# EAGLE design Stimulation_Testbed_Expansion_V2 (EAGLE 7.5.0)
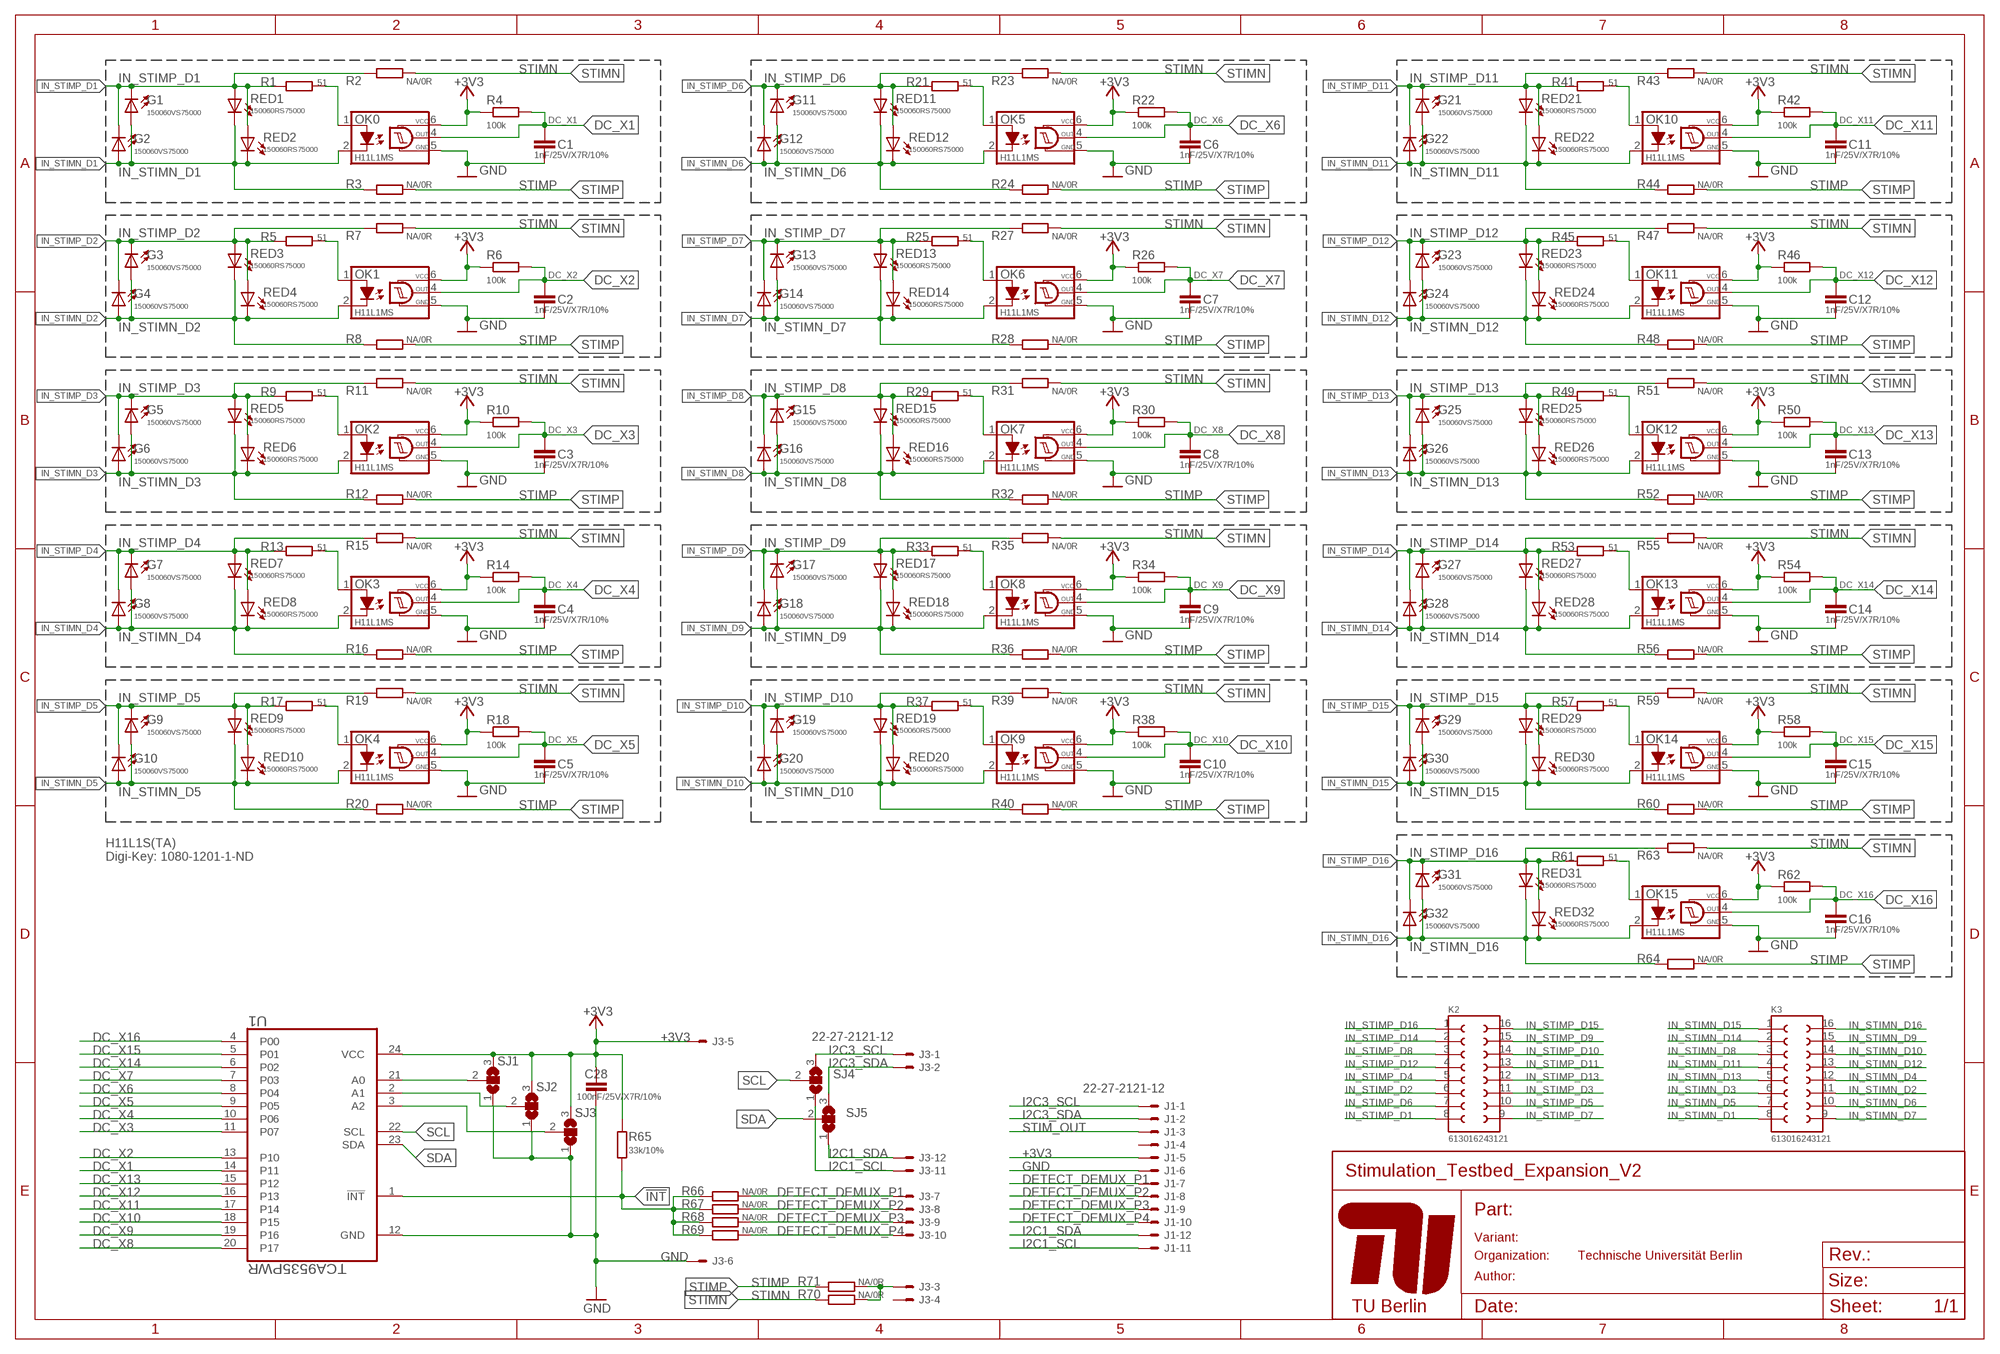
[diagram p0: schematic, sheet 1]

## Parts
C1  1nF/25V/X7R/10%  C-EUC0603  [C0603]
C2  1nF/25V/X7R/10%  C-EUC0603  [C0603]
C3  1nF/25V/X7R/10%  C-EUC0603  [C0603]
C4  1nF/25V/X7R/10%  C-EUC0603  [C0603]
C5  1nF/25V/X7R/10%  C-EUC0603  [C0603]
C6  1nF/25V/X7R/10%  C-EUC0603  [C0603]
C7  1nF/25V/X7R/10%  C-EUC0603  [C0603]
C8  1nF/25V/X7R/10%  C-EUC0603  [C0603]
C9  1nF/25V/X7R/10%  C-EUC0603  [C0603]
C10  1nF/25V/X7R/10%  C-EUC0603  [C0603]
C11  1nF/25V/X7R/10%  C-EUC0603  [C0603]
C12  1nF/25V/X7R/10%  C-EUC0603  [C0603]
C13  1nF/25V/X7R/10%  C-EUC0603  [C0603]
C14  1nF/25V/X7R/10%  C-EUC0603  [C0603]
C15  1nF/25V/X7R/10%  C-EUC0603  [C0603]
C16  1nF/25V/X7R/10%  C-EUC0603  [C0603]
C28  100nF/25V/X7R/10%  C-EUC0603K  [C0603K]
G1  150060VS75000  LEDCHIPLED_0603  [CHIPLED_0603]
G2  150060VS75000  LEDCHIPLED_0603  [CHIPLED_0603]
G3  150060VS75000  LEDCHIPLED_0603  [CHIPLED_0603]
G4  150060VS75000  LEDCHIPLED_0603  [CHIPLED_0603]
G5  150060VS75000  LEDCHIPLED_0603  [CHIPLED_0603]
G6  150060VS75000  LEDCHIPLED_0603  [CHIPLED_0603]
G7  150060VS75000  LEDCHIPLED_0603  [CHIPLED_0603]
G8  150060VS75000  LEDCHIPLED_0603  [CHIPLED_0603]
G9  150060VS75000  LEDCHIPLED_0603  [CHIPLED_0603]
G10  150060VS75000  LEDCHIPLED_0603  [CHIPLED_0603]
G11  150060VS75000  LEDCHIPLED_0603  [CHIPLED_0603]
G12  150060VS75000  LEDCHIPLED_0603  [CHIPLED_0603]
G13  150060VS75000  LEDCHIPLED_0603  [CHIPLED_0603]
G14  150060VS75000  LEDCHIPLED_0603  [CHIPLED_0603]
G15  150060VS75000  LEDCHIPLED_0603  [CHIPLED_0603]
G16  150060VS75000  LEDCHIPLED_0603  [CHIPLED_0603]
G17  150060VS75000  LEDCHIPLED_0603  [CHIPLED_0603]
G18  150060VS75000  LEDCHIPLED_0603  [CHIPLED_0603]
G19  150060VS75000  LEDCHIPLED_0603  [CHIPLED_0603]
G20  150060VS75000  LEDCHIPLED_0603  [CHIPLED_0603]
G21  150060VS75000  LEDCHIPLED_0603  [CHIPLED_0603]
G22  150060VS75000  LEDCHIPLED_0603  [CHIPLED_0603]
G23  150060VS75000  LEDCHIPLED_0603  [CHIPLED_0603]
G24  150060VS75000  LEDCHIPLED_0603  [CHIPLED_0603]
G25  150060VS75000  LEDCHIPLED_0603  [CHIPLED_0603]
G26  150060VS75000  LEDCHIPLED_0603  [CHIPLED_0603]
G27  150060VS75000  LEDCHIPLED_0603  [CHIPLED_0603]
G28  150060VS75000  LEDCHIPLED_0603  [CHIPLED_0603]
G29  150060VS75000  LEDCHIPLED_0603  [CHIPLED_0603]
G30  150060VS75000  LEDCHIPLED_0603  [CHIPLED_0603]
G31  150060VS75000  LEDCHIPLED_0603  [CHIPLED_0603]
G32  150060VS75000  LEDCHIPLED_0603  [CHIPLED_0603]
J1  22-27-2121-12  [6410-12]
J3  22-27-2121-12  [6410-12]
K2  613016243121  [613016243121]
K3  613016243121  [613016243121]
OK0  H11L1MS  [DIL6-SMD]
OK1  H11L1MS  [DIL6-SMD]
OK2  H11L1MS  [DIL6-SMD]
OK3  H11L1MS  [DIL6-SMD]
OK4  H11L1MS  [DIL6-SMD]
OK5  H11L1MS  [DIL6-SMD]
OK6  H11L1MS  [DIL6-SMD]
OK7  H11L1MS  [DIL6-SMD]
OK8  H11L1MS  [DIL6-SMD]
OK9  H11L1MS  [DIL6-SMD]
OK10  H11L1MS  [DIL6-SMD]
OK11  H11L1MS  [DIL6-SMD]
OK12  H11L1MS  [DIL6-SMD]
OK13  H11L1MS  [DIL6-SMD]
OK14  H11L1MS  [DIL6-SMD]
OK15  H11L1MS  [DIL6-SMD]
R1  51  R-EU_R0603  [R0603]
R2  NA/0R  R-EU_R0603  [R0603]
R3  NA/0R  R-EU_R0603  [R0603]
R4  100k  R-EU_R0603  [R0603]
R5  51  R-EU_R0603  [R0603]
R6  100k  R-EU_R0603  [R0603]
R7  NA/0R  R-EU_R0603  [R0603]
R8  NA/0R  R-EU_R0603  [R0603]
R9  51  R-EU_R0603  [R0603]
R10  100k  R-EU_R0603  [R0603]
R11  NA/0R  R-EU_R0603  [R0603]
R12  NA/0R  R-EU_R0603  [R0603]
R13  51  R-EU_R0603  [R0603]
R14  100k  R-EU_R0603  [R0603]
R15  NA/0R  R-EU_R0603  [R0603]
R16  NA/0R  R-EU_R0603  [R0603]
R17  51  R-EU_R0603  [R0603]
R18  100k  R-EU_R0603  [R0603]
R19  NA/0R  R-EU_R0603  [R0603]
R20  NA/0R  R-EU_R0603  [R0603]
R21  51  R-EU_R0603  [R0603]
R22  100k  R-EU_R0603  [R0603]
R23  NA/0R  R-EU_R0603  [R0603]
R24  NA/0R  R-EU_R0603  [R0603]
R25  51  R-EU_R0603  [R0603]
R26  100k  R-EU_R0603  [R0603]
R27  NA/0R  R-EU_R0603  [R0603]
R28  NA/0R  R-EU_R0603  [R0603]
R29  51  R-EU_R0603  [R0603]
R30  100k  R-EU_R0603  [R0603]
R31  NA/0R  R-EU_R0603  [R0603]
R32  NA/0R  R-EU_R0603  [R0603]
R33  51  R-EU_R0603  [R0603]
R34  100k  R-EU_R0603  [R0603]
R35  NA/0R  R-EU_R0603  [R0603]
R36  NA/0R  R-EU_R0603  [R0603]
R37  51  R-EU_R0603  [R0603]
R38  100k  R-EU_R0603  [R0603]
R39  NA/0R  R-EU_R0603  [R0603]
R40  NA/0R  R-EU_R0603  [R0603]
R41  51  R-EU_R0603  [R0603]
R42  100k  R-EU_R0603  [R0603]
R43  NA/0R  R-EU_R0603  [R0603]
R44  NA/0R  R-EU_R0603  [R0603]
R45  51  R-EU_R0603  [R0603]
R46  100k  R-EU_R0603  [R0603]
R47  NA/0R  R-EU_R0603  [R0603]
R48  NA/0R  R-EU_R0603  [R0603]
R49  51  R-EU_R0603  [R0603]
R50  100k  R-EU_R0603  [R0603]
R51  NA/0R  R-EU_R0603  [R0603]
R52  NA/0R  R-EU_R0603  [R0603]
R53  51  R-EU_R0603  [R0603]
R54  100k  R-EU_R0603  [R0603]
R55  NA/0R  R-EU_R0603  [R0603]
R56  NA/0R  R-EU_R0603  [R0603]
R57  51  R-EU_R0603  [R0603]
R58  100k  R-EU_R0603  [R0603]
R59  NA/0R  R-EU_R0603  [R0603]
R60  NA/0R  R-EU_R0603  [R0603]
R61  51  R-EU_R0603  [R0603]
R62  100k  R-EU_R0603  [R0603]
R63  NA/0R  R-EU_R0603  [R0603]
R64  NA/0R  R-EU_R0603  [R0603]
R65  33k/10%  R-EU_R0603  [R0603]
R66  NA/0R  R-EU_R0603  [R0603]
R67  NA/0R  R-EU_R0603  [R0603]
R68  NA/0R  R-EU_R0603  [R0603]
R69  NA/0R  R-EU_R0603  [R0603]
R70  NA/0R  R-EU_R0603  [R0603]
R71  NA/0R  R-EU_R0603  [R0603]
RED1  150060RS75000  LEDCHIP-LED0603  [CHIP-LED0603]
RED2  150060RS75000  LEDCHIP-LED0603  [CHIP-LED0603]
RED3  150060RS75000  LEDCHIP-LED0603  [CHIP-LED0603]
RED4  150060RS75000  LEDCHIP-LED0603  [CHIP-LED0603]
RED5  150060RS75000  LEDCHIP-LED0603  [CHIP-LED0603]
RED6  150060RS75000  LEDCHIP-LED0603  [CHIP-LED0603]
RED7  150060RS75000  LEDCHIP-LED0603  [CHIP-LED0603]
RED8  150060RS75000  LEDCHIP-LED0603  [CHIP-LED0603]
RED9  150060RS75000  LEDCHIP-LED0603  [CHIP-LED0603]
RED10  150060RS75000  LEDCHIP-LED0603  [CHIP-LED0603]
RED11  150060RS75000  LEDCHIP-LED0603  [CHIP-LED0603]
RED12  150060RS75000  LEDCHIP-LED0603  [CHIP-LED0603]
RED13  150060RS75000  LEDCHIP-LED0603  [CHIP-LED0603]
RED14  150060RS75000  LEDCHIP-LED0603  [CHIP-LED0603]
RED15  150060RS75000  LEDCHIP-LED0603  [CHIP-LED0603]
RED16  150060RS75000  LEDCHIP-LED0603  [CHIP-LED0603]
RED17  150060RS75000  LEDCHIP-LED0603  [CHIP-LED0603]
RED18  150060RS75000  LEDCHIP-LED0603  [CHIP-LED0603]
RED19  150060RS75000  LEDCHIP-LED0603  [CHIP-LED0603]
RED20  150060RS75000  LEDCHIP-LED0603  [CHIP-LED0603]
RED21  150060RS75000  LEDCHIP-LED0603  [CHIP-LED0603]
RED22  150060RS75000  LEDCHIP-LED0603  [CHIP-LED0603]
RED23  150060RS75000  LEDCHIP-LED0603  [CHIP-LED0603]
RED24  150060RS75000  LEDCHIP-LED0603  [CHIP-LED0603]
RED25  150060RS75000  LEDCHIP-LED0603  [CHIP-LED0603]
RED26  150060RS75000  LEDCHIP-LED0603  [CHIP-LED0603]
RED27  150060RS75000  LEDCHIP-LED0603  [CHIP-LED0603]
RED28  150060RS75000  LEDCHIP-LED0603  [CHIP-LED0603]
RED29  150060RS75000  LEDCHIP-LED0603  [CHIP-LED0603]
RED30  150060RS75000  LEDCHIP-LED0603  [CHIP-LED0603]
RED31  150060RS75000  LEDCHIP-LED0603  [CHIP-LED0603]
RED32  150060RS75000  LEDCHIP-LED0603  [CHIP-LED0603]
SJ1  SJ2W  [SJ_2]
SJ2  SJ2W  [SJ_2]
SJ3  SJ2W  [SJ_2]
SJ4  SJ2W  [SJ_2]
SJ5  SJ2W  [SJ_2]
U1  TCA9535PWR  [SOP65P640X120-24N]

## Nets
!INT: R65.1 R66.2 R67.2 R68.2 R69.2 U1.1(!INT)
+3V3: C28.1 J1.5 J3.5 OK0.6(VCC) OK1.6(VCC) OK2.6(VCC) OK3.6(VCC) OK4.6(VCC) OK5.6(VCC) OK6.6(VCC) OK7.6(VCC) OK8.6(VCC) OK9.6(VCC) OK10.6(VCC) OK11.6(VCC) OK12.6(VCC) OK13.6(VCC) OK14.6(VCC) OK15.6(VCC) R4.1 R6.1 R10.1 R14.1 R18.1 R22.1 R26.1 R30.1 R34.1 R38.1 R42.1 R46.1 R50.1 R54.1 R58.1 R62.1 R65.2 SJ1.3 SJ2.3 SJ3.3 U1.24(VCC)
DC_X1: C1.1 OK0.4(OUT) R4.2 U1.14(P11)
DC_X2: C2.1 OK1.4(OUT) R6.2 U1.13(P10)
DC_X3: C3.1 OK2.4(OUT) R10.2 U1.11(P07)
DC_X4: C4.1 OK3.4(OUT) R14.2 U1.10(P06)
DC_X5: C5.1 OK4.4(OUT) R18.2 U1.9(P05)
DC_X6: C6.1 OK5.4(OUT) R22.2 U1.8(P04)
DC_X7: C7.1 OK6.4(OUT) R26.2 U1.7(P03)
DC_X8: C8.1 OK7.4(OUT) R30.2 U1.20(P17)
DC_X9: C9.1 OK8.4(OUT) R34.2 U1.19(P16)
DC_X10: C10.1 OK9.4(OUT) R38.2 U1.18(P15)
DC_X11: C11.1 OK10.4(OUT) R42.2 U1.17(P14)
DC_X12: C12.1 OK11.4(OUT) R46.2 U1.16(P13)
DC_X13: C13.1 OK12.4(OUT) R50.2 U1.15(P12)
DC_X14: C14.1 OK13.4(OUT) R54.2 U1.6(P02)
DC_X15: C15.1 OK14.4(OUT) R58.2 U1.5(P01)
DC_X16: C16.1 OK15.4(OUT) R62.2 U1.4(P00)
DETECT_DEMUX_P1: J1.7 J3.7 R66.1
DETECT_DEMUX_P2: J1.8 J3.8 R67.1
DETECT_DEMUX_P3: J1.9 J3.9 R68.1
DETECT_DEMUX_P4: J1.10 J3.10 R69.1
GND: C1.2 C2.2 C3.2 C4.2 C5.2 C6.2 C7.2 C8.2 C9.2 C10.2 C11.2 C12.2 C13.2 C14.2 C15.2 C16.2 C28.2 J1.6 J3.6 OK0.5(GND) OK1.5(GND) OK2.5(GND) OK3.5(GND) OK4.5(GND) OK5.5(GND) OK6.5(GND) OK7.5(GND) OK8.5(GND) OK9.5(GND) OK10.5(GND) OK11.5(GND) OK12.5(GND) OK13.5(GND) OK14.5(GND) OK15.5(GND) SJ1.1 SJ2.1 SJ3.1 U1.12(GND)
I2C1_SCL: J1.11 J3.11 SJ4.1
I2C1_SDA: J1.12 J3.12 SJ5.1
I2C3_SCL: J1.1 J3.1 SJ4.3
I2C3_SDA: J1.2 J3.2 SJ5.3
IN_STIMN_D1: G1.A G2.A K3.8 OK0.2(C) R3.2 RED1.C RED2.C
IN_STIMN_D2: G3.A G4.A K3.11 OK1.2(C) R8.2 RED3.C RED4.C
IN_STIMN_D3: G5.A G6.A K3.6 OK2.2(C) R12.2 RED5.C RED6.C
IN_STIMN_D4: G7.A G8.A K3.12 OK3.2(C) R16.2 RED7.C RED8.C
IN_STIMN_D5: G9.A G10.A K3.7 OK4.2(C) R20.2 RED9.C RED10.C
IN_STIMN_D6: G11.A G12.A K3.10 OK5.2(C) R24.2 RED11.C RED12.C
IN_STIMN_D7: G13.A G14.A K3.9 OK6.2(C) R28.2 RED13.C RED14.C
IN_STIMN_D8: G15.A G16.A K3.3 OK7.2(C) R32.2 RED15.C RED16.C
IN_STIMN_D9: G17.A G18.A K3.15 OK8.2(C) R36.2 RED17.C RED18.C
IN_STIMN_D10: G19.A G20.A K3.14 OK9.2(C) R40.2 RED19.C RED20.C
IN_STIMN_D11: G21.A G22.A K3.4 OK10.2(C) R44.2 RED21.C RED22.C
IN_STIMN_D12: G23.A G24.A K3.13 OK11.2(C) R48.2 RED23.C RED24.C
IN_STIMN_D13: G25.A G26.A K3.5 OK12.2(C) R52.2 RED25.C RED26.C
IN_STIMN_D14: G27.A G28.A K3.2 OK13.2(C) R56.2 RED27.C RED28.C
IN_STIMN_D15: G29.A G30.A K3.1 OK14.2(C) R60.2 RED29.C RED30.C
IN_STIMN_D16: G31.A G32.A K3.16 OK15.2(C) R64.2 RED31.C RED32.C
IN_STIMP_D1: G1.C G2.C K2.8 R1.2 R2.2 RED1.A RED2.A
IN_STIMP_D2: G3.C G4.C K2.6 R5.2 R7.2 RED3.A RED4.A
IN_STIMP_D3: G5.C G6.C K2.11 R9.2 R11.2 RED5.A RED6.A
IN_STIMP_D4: G7.C G8.C K2.5 R13.2 R15.2 RED7.A RED8.A
IN_STIMP_D5: G9.C G10.C K2.10 R17.2 R19.2 RED9.A RED10.A
IN_STIMP_D6: G11.C G12.C K2.7 R21.2 R23.2 RED11.A RED12.A
IN_STIMP_D7: G13.C G14.C K2.9 R25.2 R27.2 RED13.A RED14.A
IN_STIMP_D8: G15.C G16.C K2.3 R29.2 R31.2 RED15.A RED16.A
IN_STIMP_D9: G17.C G18.C K2.15 R33.2 R35.2 RED17.A RED18.A
IN_STIMP_D10: G19.C G20.C K2.14 R37.2 R39.2 RED19.A RED20.A
IN_STIMP_D11: G21.C G22.C K2.13 R41.2 R43.2 RED21.A RED22.A
IN_STIMP_D12: G23.C G24.C K2.4 R45.2 R47.2 RED23.A RED24.A
IN_STIMP_D13: G25.C G26.C K2.12 R49.2 R51.2 RED25.A RED26.A
IN_STIMP_D14: G27.C G28.C K2.2 R53.2 R55.2 RED27.A RED28.A
IN_STIMP_D15: G29.C G30.C K2.16 R57.2 R59.2 RED29.A RED30.A
IN_STIMP_D16: G31.C G32.C K2.1 R61.2 R63.2 RED31.A RED32.A
N$1: OK1.1(A) R5.1
N$2: OK2.1(A) R9.1
N$3: OK3.1(A) R13.1
N$4: OK4.1(A) R17.1
N$5: OK5.1(A) R21.1
N$6: OK6.1(A) R25.1
N$7: OK7.1(A) R29.1
N$8: OK9.1(A) R37.1
N$9: OK8.1(A) R33.1
N$10: OK10.1(A) R41.1
N$11: OK11.1(A) R45.1
N$12: OK12.1(A) R49.1
N$13: OK13.1(A) R53.1
N$14: OK14.1(A) R57.1
N$15: OK15.1(A) R61.1
N$16: SJ1.2 U1.21(A0)
N$17: SJ2.2 U1.2(A1)
N$18: SJ3.2 U1.3(A2)
N$30: OK0.1(A) R1.1
SCL: SJ4.2 U1.22(SCL)
SDA: SJ5.2 U1.23(SDA)
STIM_OUT: J1.3 J3.3 R70.1 R71.1
STIMN: R2.1 R7.1 R11.1 R15.1 R19.1 R23.1 R27.1 R31.1 R35.1 R39.1 R43.1 R47.1 R51.1 R55.1 R59.1 R63.1 R70.2
STIMP: R3.1 R8.1 R12.1 R16.1 R20.1 R24.1 R28.1 R32.1 R36.1 R40.1 R44.1 R48.1 R52.1 R56.1 R60.1 R64.1 R71.2
Unconnected: J1.4 J3.4

## Notes on the sheet
- H11L1S(TA)
  Digi-Key: 1080-1201-1-ND

## Library data of the parts
C1-C16 C28 = rcl:C-EU: CAPACITOR, European symbol
G1-G32 RED1-RED32 = led:LED: LED OSRAM: - CHIPLED LG R971, LG N971, LY N971, LG Q971, LY Q971, LO R971, LY R971 LH N974, LH R974 LS Q976, LO Q976, LY Q976 LO Q996 - Hyper CHIPLED LW Q18S LB Q993, LB Q99A, LB R99A - SideLED LS A670, LO A670, LY A670, LG A670, LP A670 LB A673, LV A673, LT A673, LW A673 LH A674 LY A675 LS A676, LA A676, LO A676, LY A676, LW A676 LS A679, LY A679, LG A679 - Hyper Micro SIDELED® LS Y876, LA Y876, LO Y876, LY Y876 LT Y87S - SmartLED LW L88C, LW L88S LB L89C, LB L89S, LG L890 LS L89K, LO L89K, LY L89K LS L896, LA L896, LO L896, LY L896 - TOPLED LS T670, LO T670, LY T670, LG T670, LP T670 LSG T670, LSP T670, LSY T670, LOP T670, LYG T670 LG T671, LOG T671, LSG T671 LB T673, LV T673, LT T673, LW T673 LH T674 LS T676, LA T676, LO T676, LY T676, LB T676, LH T676, LSB T676, LW T676 LB T67C, LV T67C, LT T67C, LS T67K, LO T67K, LY T67K, LW E67C LS E67B, LA E67B, LO E67B, LY E67B, LB E67C, LV E67C, LT E67C LW T67C LS T679, LY T679, LG T679 LS T770, LO T770, LY T770, LG T770, LP T770 LB T773, LV T773, LT T773, LW T773 LH T774 LS E675, LA E675, LY E675, LS T675 LS T776, LA T776, LO T776, LY T776, LB T776 LHGB T686 LT T68C, LB T68C - Hyper Mini TOPLED® LB M676 - Mini TOPLED Santana® LG M470 LS M47K, LO M47K, LY M47K Source: http://www.osram.convergy.de LUXEON: - LUMILED® LXK2-PW12-R00, LXK2-PW12-S00, LXK2-PW14-U00, LXK2-PW14-V00 LXK2-PM12-R00, LXK2-PM12-S00, LXK2-PM14-U00 LXK2-PE12-Q00, LXK2-PE12-R00, LXK2-PE12-S00, LXK2-PE14-T00, LXK2-PE14-U00 LXK2-PB12-K00, LXK2-PB12-L00, LXK2-PB12-M00, LXK2-PB14-N00, LXK2-PB14-P00, LXK2-PB14-Q00 LXK2-PR12-L00, LXK2-PR12-M00, LXK2-PR14-Q00, LXK2-PR14-R00 LXK2-PD12-Q00, LXK2-PD12-R00, LXK2-PD12-S00 LXK2-PH12-R00, LXK2-PH12-S00 LXK2-PL12-P00, LXK2-PL12-Q00, LXK2-PL12-R00 Source: www.luxeon.com KINGBRIGHT: KA-3528ASYC Source: www.kingbright.com
J1 J3 = con-molex:22-?-12: CONNECTOR wire to board 2.54 mm (.1 inch) pitch header; OC_FARNELL: unknown; OC_NEWARK: unknown
K2 K3 = Board-to-Board:613016243121: WR-PHD Angled Dual Socket Header, 16 Pins =>Code : Con_BTB_SHD_2.54_2_613016243121 <http://katalog.we-online.de/media/images/eican/Con_BTB_SHD_2.54_2_6130xx243121_pf2.jpg> Details see: http://katalog.we-online.de/en/em/613_0xx_243_121 Created 2014-05-30, Karrer Zheng 2014 (C) Würth Elektronik
OK0 OK1-OK15 = optocoupler:H11L*M: 6-Pin DIP Optocoupler Source: http://www.fairchildsemi.com/ds/H1/H11L2-M.pdf; OC_FARNELL: unknown; OC_NEWARK: unknown
R1-R71 = resistor:R-EU_: RESISTOR, European symbol
SJ1-SJ5 = jumper:SJ2W: SMD solder JUMPER
U1 = TCA9535PWR:TCA9535PWR: I/O EXPANDER; AVAILABILITY: Good; DESCRIPTION: Remote 16-Bit I2C and SMBus, Low-Power I/O Expander With Interrupt Output and Config Registers 24-TSSOP -40 to 85; MF: Texas Instruments; MP: TCA9535PWR; PACKAGE: TSSOP-24 Texas Instruments; PRICE: 0.88 USD

## Board
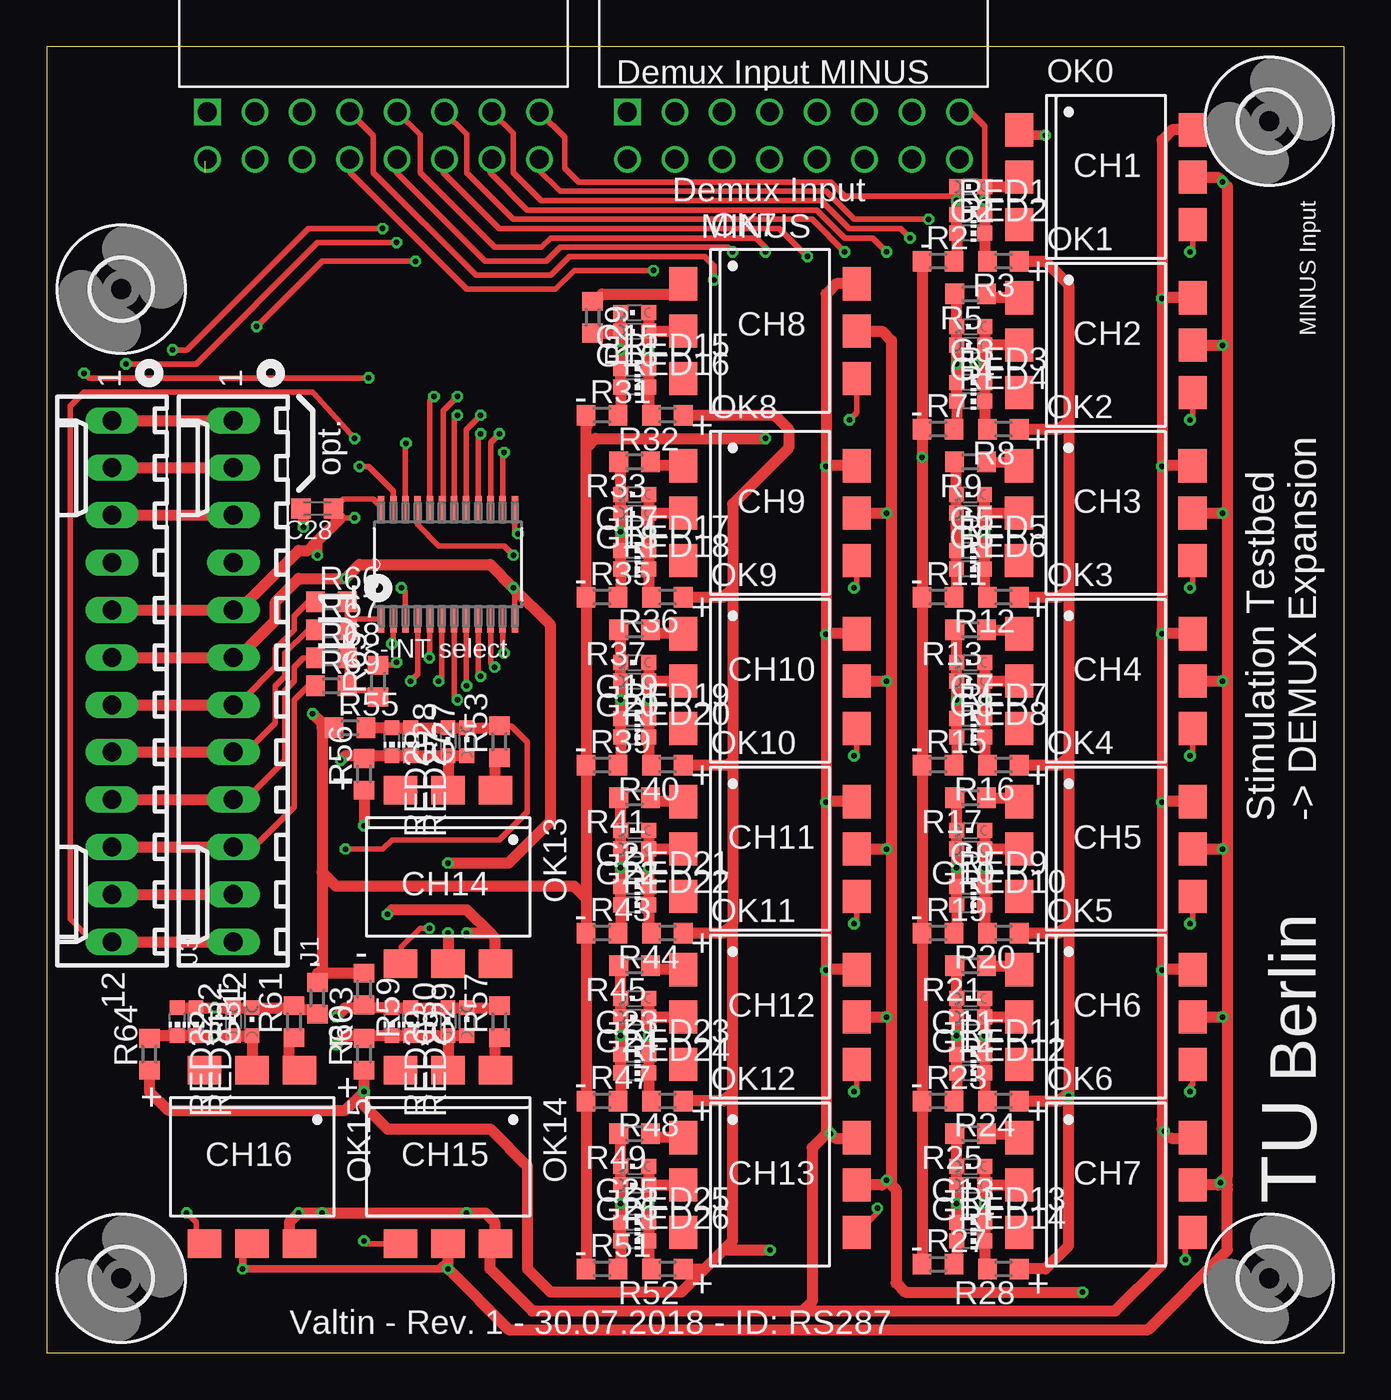
[diagram p1: board, top side]
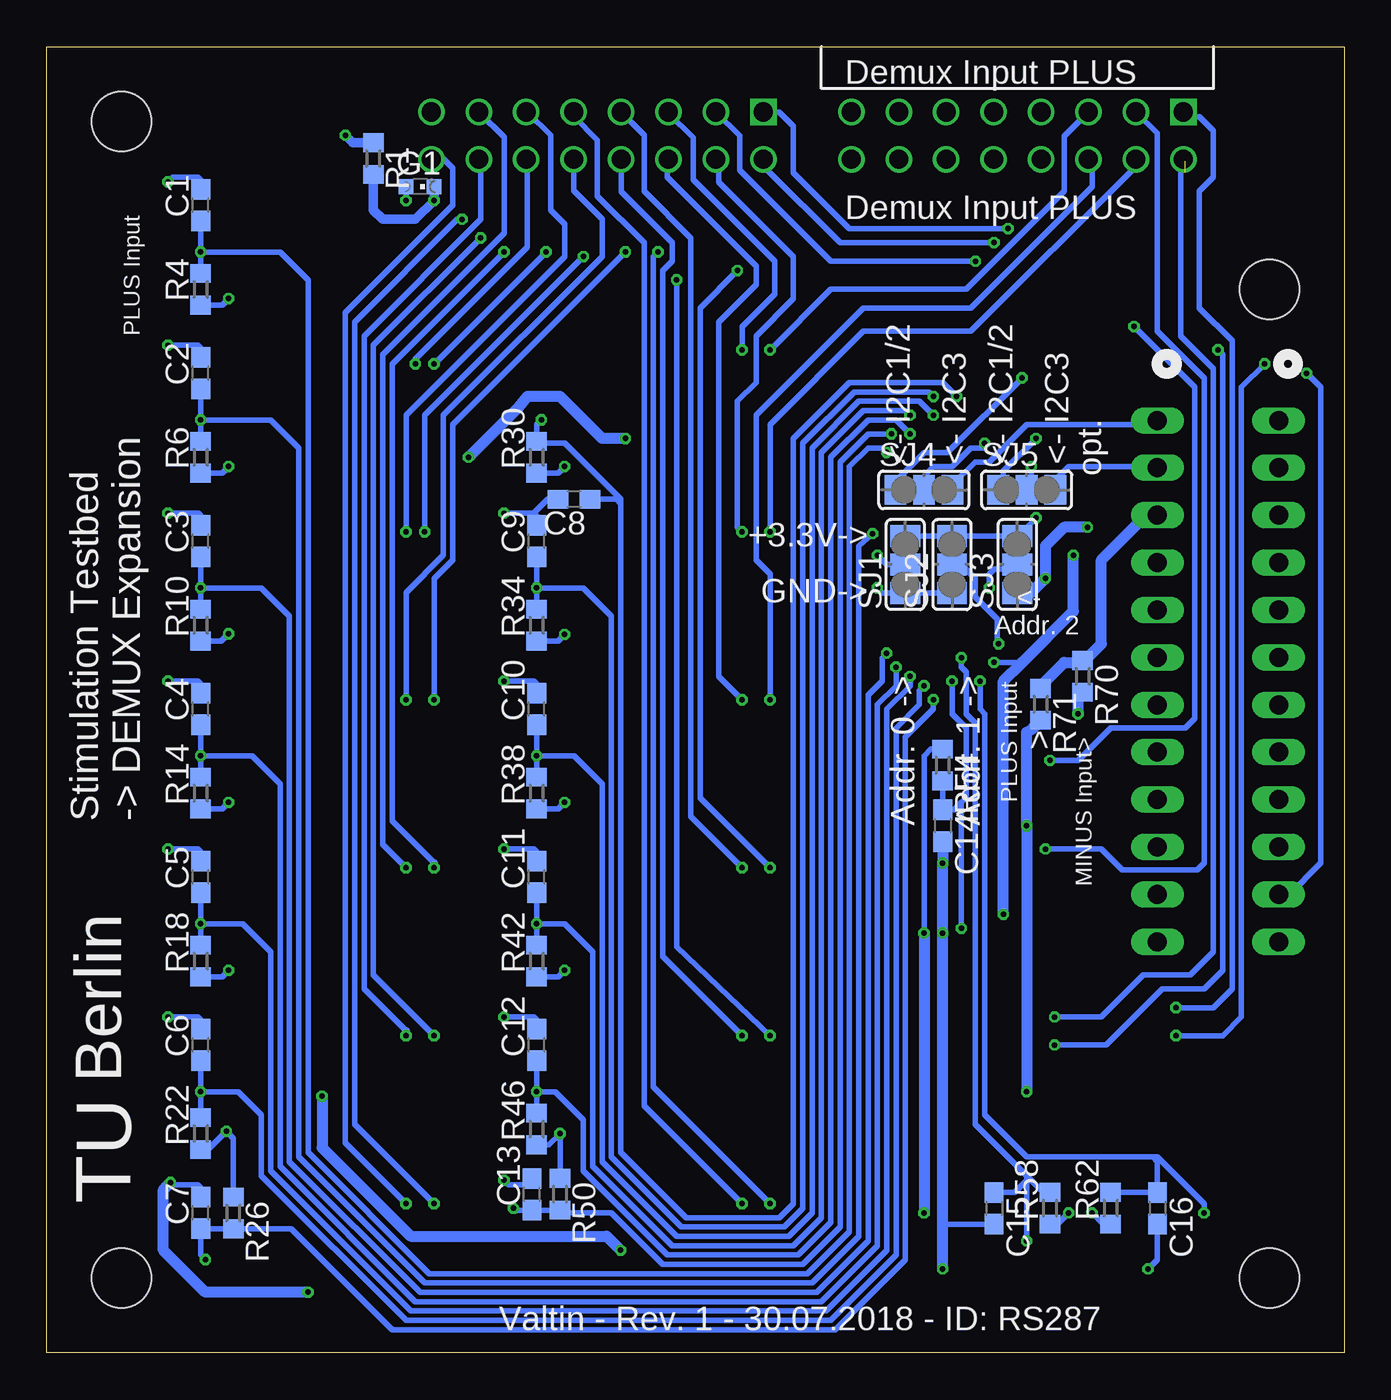
[diagram p2: board, bottom side, seen from below]

Size 69.5 x 70 mm. Coordinates in mm from the lower left corner, seen from the top.
Outline: 69.5,0 69.5,70 0,70 0,0 69.5,0
Copper layers (1*16): Top 0.035mm / dielectric 1.5mm / Bottom 0.035mm
Design rules "PCB-POOL Standard": minimum track width 0.15mm, minimum drill 0.3mm, track to track 0.15mm, track to pad 0.15mm, pad to pad 0.15mm, via to via 0.15mm, smd to smd 0.15mm, copper to edge 0.3mm, drill to drill 0.2mm, minimum pad ring 0.2mm, minimum via ring 0.15mm, stop-mask expansion 0.075mm, vias tented up to drill 0mil, thermal gap 0.2mm

### Footprints (pad centres in the part's own frame; a part is rotated, then mirrored left to right if it is on the bottom)
C0603 = smd 1.1 x 1: 1 -0.85,0; 2 0.85,0
C0603K = smd 1.05 x 1.08: 1 -0.875,0; 2 0.875,0
CHIPLED_0603 = smd 0.8 x 0.8: A 0,-0.75; C 0,0.75
6410-12 = drill 1.016 long: 1 13.97,0; 2 11.43,0; 3 8.89,0; 4 6.35,0; 5 3.81,0; 6 1.27,0; 7 -1.27,0; 8 -3.81,0; 9 -6.35,0; 10 -8.89,0; 11 -11.43,0; 12 -13.97,0
613016243121 = drill 1.02 square: 1 -8.89,0 | drill 1.02: 2 -6.35,0; 3 -3.81,0; 4 -1.27,0; 5 1.27,0; 6 3.81,0; 7 6.35,0; 8 8.89,0; 9 8.89,-2.54; 10 6.35,-2.54; 11 3.81,-2.54; 12 1.27,-2.54; 13 -1.27,-2.54; 14 -3.81,-2.54; 15 -6.35,-2.54; 16 -8.89,-2.54
DIL6-SMD = smd 1.78 x 1.52: 1 -2.54,-4.645; 2 0,-4.645; 3 2.54,-4.645; 4 2.54,4.645; 5 0,4.645; 6 -2.54,4.645
R0603 = smd 1 x 1.1: 1 -0.85,0; 2 0.85,0
CHIP-LED0603 = smd 0.8 x 0.8: A 0,-0.75; C 0,0.75
SJ_2 = smd 1.168 x 1.6: 1 -1.524,0; 2 0,0; 3 1.524,0
SOP65P640X120-24N = smd 1.473 x 0.356: 1 -2.921,3.581; 2 -2.921,2.921; 3 -2.921,2.286; 4 -2.921,1.626; 5 -2.921,0.965; 6 -2.921,0.33; 7 -2.921,-0.33; 8 -2.921,-0.965; 9 -2.921,-1.626; 10 -2.921,-2.286; 11 -2.921,-2.921; 12 -2.921,-3.581; 13 2.921,-3.581; 14 2.921,-2.921; 15 2.921,-2.286; 16 2.921,-1.626; 17 2.921,-0.965; 18 2.921,-0.33; 19 2.921,0.33; 20 2.921,0.965; 21 2.921,1.626; 22 2.921,2.286; 23 2.921,2.921; 24 2.921,3.581
3,2 = hole 3.2: 0,0

### Placement (x,y rotation side)
C1  61.25,61.5 90 bottom
C2  61.25,52.5 90 bottom
C3  61.25,43.5 90 bottom
C4  61.25,34.5 90 bottom
C5  61.25,25.5 90 bottom
C6  61.25,16.5 90 bottom
C7  61.25,7.5 90 bottom
C8  41.25,45.75 180 bottom
C9  43.25,43.5 90 bottom
C10  43.25,34.5 90 bottom
C11  43.25,25.5 90 bottom
C12  43.25,16.5 90 bottom
C13  43.5,8.5 90 bottom
C14  21.5,28.25 270 bottom
C15  18.75,7.75 270 bottom
C16  10,7.75 270 bottom
C28  14.5,45.25 180 top
G1  49.5,62.5 270 bottom
G2  49.5,62.5 90 top
G3  49.5,55 90 top
G4  49.5,54 90 top
G5  49.49,46 90 top
G6  49.49,45 90 top
G7  49.5,37 90 top
G8  49.5,36 90 top
G9  49.5,28 90 top
G10  49.5,27 90 top
G11  49.5,19 90 top
G12  49.5,18 90 top
G13  49.5,10 90 top
G14  49.5,9 90 top
G15  31.5,55.75 90 top
G16  31.5,54.75 90 top
G17  31.5,46 90 top
G18  31.5,45 90 top
G19  31.5,37 90 top
G20  31.5,36 90 top
G21  31.5,28 90 top
G22  31.5,27 90 top
G23  31.5,19 90 top
G24  31.5,18 90 top
G25  31.5,10 90 top
G26  31.5,9 90 top
G27  22.5,32.75 0 top
G28  21.5,32.75 0 top
G29  22.5,17.75 0 top
G30  21.5,17.75 0 top
G31  11,17.75 0 top
G32  10,17.75 0 top
J1  10,36 90 top
J3  3.5,36 90 top
K2  17.5,66.5 0 top
K3  40,66.5 0 top
OK0  56.75,63 270 top
OK1  56.75,54 270 top
OK2  56.74,45 270 top
OK3  56.75,36 270 top
OK4  56.75,27 270 top
OK5  56.75,18 270 top
OK6  56.75,9 270 top
OK7  38.75,54.75 270 top
OK8  38.75,45 270 top
OK9  38.75,36 270 top
OK10  38.75,27 270 top
OK11  38.75,18 270 top
OK12  38.75,9 270 top
OK13  21.5,25.5 180 top
OK14  21.5,10.5 180 top
OK15  11,10.5 180 top
R1  52,64 270 bottom
R2  47.75,58.5 0 top
R3  51.25,58.5 180 top
R4  61.25,57 90 bottom
R5  49.5,56.75 180 top
R6  61.25,48 90 bottom
R7  47.75,49.5 0 top
R8  51.25,49.5 180 top
R9  49.49,47.75 180 top
R10  61.25,39 90 bottom
R11  47.75,40.5 0 top
R12  51.25,40.5 180 top
R13  49.5,38.75 180 top
R14  61.25,30 90 bottom
R15  47.75,31.5 0 top
R16  51.25,31.5 180 top
R17  49.5,29.75 180 top
R18  61.25,21 90 bottom
R19  47.75,22.5 0 top
R20  51.25,22.5 180 top
R21  49.5,20.75 180 top
R22  61.25,11.75 90 bottom
R23  47.75,13.5 0 top
R24  51.25,13.5 180 top
R25  49.5,11.75 180 top
R26  59.5,7.5 270 bottom
R27  47.75,4.75 0 top
R28  51.25,4.5 180 top
R29  29.25,55.5 270 top
R30  43.25,48 90 bottom
R31  29.75,50.25 0 top
R32  33.25,50.25 180 top
R33  31.5,47.75 180 top
R34  43.25,39 90 bottom
R35  29.75,40.5 0 top
R36  33.25,40.5 180 top
R37  31.5,38.75 180 top
R38  43.25,30 90 bottom
R39  29.75,31.5 0 top
R40  33.25,31.5 180 top
R41  31.5,29.75 180 top
R42  43.25,21 90 bottom
R43  29.75,22.5 0 top
R44  33.25,22.5 180 top
R45  31.5,20.75 180 top
R46  43.25,12 90 bottom
R47  29.75,13.5 0 top
R48  33.25,13.5 180 top
R49  31.5,11.75 180 top
R50  42,8.5 270 bottom
R51  29.75,4.5 0 top
R52  33.25,4.5 180 top
R53  24.25,32.75 90 top
R54  21.5,31.5 270 bottom
R55  16.25,33.5 0 top
R56  17,31 90 top
R57  24.25,17.75 90 top
R58  15.75,7.75 90 bottom
R59  17,19.5 270 top
R60  17,16 90 top
R61  13.25,17.75 90 top
R62  12.5,7.75 90 bottom
R63  14.5,19 270 top
R64  5.5,16 90 top
R65  17.75,36 90 top
R66  15.25,40.25 0 top
R67  15.25,38.75 0 top
R68  15.25,37.25 0 top
R69  15.25,35.75 0 top
R70  14,36.25 270 bottom
R71  16.25,34.75 270 bottom
RED1  49.5,61 270 top
RED2  49.5,60 270 top
RED3  49.5,52 270 top
RED4  49.5,51 270 top
RED5  49.49,43 270 top
RED6  49.49,42 270 top
RED7  49.5,34 270 top
RED8  49.5,33 270 top
RED9  49.5,25 270 top
RED10  49.5,24 270 top
RED11  49.5,16 270 top
RED12  49.5,15 270 top
RED13  49.5,7 270 top
RED14  49.5,6 270 top
RED15  31.5,52.75 270 top
RED16  31.5,51.75 270 top
RED17  31.5,43 270 top
RED18  31.5,42 270 top
RED19  31.5,34 270 top
RED20  31.5,33 270 top
RED21  31.5,25 270 top
RED22  31.5,24 270 top
RED23  31.5,16 270 top
RED24  31.5,15 270 top
RED25  31.5,7 270 top
RED26  31.5,6 270 top
RED27  19.5,32.75 180 top
RED28  18.5,32.75 180 top
RED29  19.5,17.75 180 top
RED30  18.5,17.75 180 top
RED31  8,17.75 180 top
RED32  7,17.75 180 top
SJ1  23.5,42.25 90 bottom
SJ2  21,42.25 90 bottom
SJ3  17.5,42.25 90 bottom
SJ4  22.5,46.25 0 bottom
SJ5  17,46.25 0 bottom
U1  21.5,42.25 90 top
U$1  [3,2]  65.5,66 0 top
U$2  [3,2]  4,4 0 top
U$3  [3,2]  4,57 0 top
U$4  [3,2]  65.5,4 0 top

### Tracks (layer width: path | path; a pad name or v marks a point on that pad's centre or on a via)
!INT
  Top 0.3: R66.2 R67.2 | U1.1 16.18,39.33 R67.2 | 16,40.1 R66.2 | R67.2 R68.2 R69.2 16.25,35.75 16.5,35.5 17.4,35.5 R65.1 | 16,40.35 R66.2
+3V3  (via drill 0.3)
  Top 0.3: U1.24 17.92,45.33 17.5,45.75 15.88,45.75 C28.1 15.88,44.75 | v16.5,44.75 15.88,44.75 | 15.88,44.75 15.75,44.75 | 59.75,12.5 59.88,12.38 v59.88,11.88 60.25,11.5 | v59.75,38.54 59.96,38.54 59.75,38.75 | R65.2 18.6,36.85 v18.75,37
  Top 0.6: J3.5 J1.5 10.31,39.81 13.5,43 14,43 14.5,43.5 | OK0.6 60.29,65.54 59.75,65 v59.75,56.5 | v59.75,56.5 v59.75,47.5 | v59.75,47.5 59.75,38.75 v59.75,38.54 | v59.75,38.54 59.75,38.5 | 59.75,38.5 v59.75,29.5 | v59.75,29.5 v59.75,20.5 | v59.75,20.5 59.75,12.5 59.75,12 | 60.25,11.5 61.35,11.5 OK6.6 | OK5.6 59.79,20.54 v59.75,20.5 | OK4.6 59.79,29.54 v59.75,29.5 | OK3.6 v59.75,38.54 | v59.75,38.54 59.79,38.54 59.75,38.5 | OK2.6 59.79,47.54 v59.75,47.5 | OK1.6 59.79,56.54 v59.75,56.5 | OK7.6 42.29,57.29 41.75,56.75 v41.75,47.5 | v41.75,47.5 v41.75,38.5 | v41.75,38.5 v41.75,29.5 | v41.75,29.5 v41.75,20.5 | v41.75,20.5 41.75,11.75 | OK12.6 43.35,11.5 42.25,11.5 v42,11.75 41.75,11.75 | OK11.6 41.79,20.54 v41.75,20.5 | OK10.6 41.79,29.54 v41.75,29.5 | OK9.6 41.79,38.54 v41.75,38.5 | OK8.6 41.79,47.54 v41.75,47.5 | OK15.6 13,6 13,7 v13.5,7.5 v14.75,7.5 v22.5,7.5 23.5,7.5 24,7 24,5.89 OK14.6 | 24,5.82 OK14.6 | v22.5,22.5 23.75,22.5 | OK13.6 24,20.89 24,22.25 23.75,22.5 | 15.5,44.75 15.75,44.75 14.5,43.5 | v59.88,11.88 59.75,12 | 59.75,12 59.75,4.75 57.25,2.25 40.5,2.25 | OK14.6 23.75,5.57 23.75,4.5 26,2.25 40.5,2.25 | 23.75,22.5 22.5,23.75 18.5,23.75 v18.25,23.5 | v14.5,42.75 14.5,43.5 | 41.75,11.75 41,11 41,2.75 40.5,2.25
  Bottom 0.3: R22.1 60.85,10.9 v59.88,11.88 59.5,11.5 R26.1 | R18.1 60.1,20.15 v59.75,20.5 | R14.1 60.1,29.15 v59.75,29.5 | R10.1 60.14,38.15 v59.75,38.54 | R6.1 60.1,47.15 v59.75,47.5 | R4.1 60.1,56.15 v59.75,56.5 | R30.1 42.1,47.15 v41.75,47.5 | R34.1 42.1,38.15 v41.75,38.5 | R38.1 42.1,29.15 v41.75,29.5 | R42.1 42.1,20.15 v41.75,20.5 | R46.1 42.6,11.15 v42,11.75 R50.1 | R54.1 22.15,32.35 22.5,32 v22.5,22.5 | R62.1 12.9,6.9 v13.5,7.5 | R58.1 15.35,6.9 v14.75,7.5 | v16.5,44.75 17.48,43.77 SJ3.3 SJ2.3 SJ1.3 | v18.75,37 17.25,37
  Bottom 0.6: v22.5,22.5 v22.5,7.5 | v18.25,23.5 18.25,36 17.25,37 14.5,39.75 v14.5,42.75
DC_X1  (via drill 0.3)
  Top 0.3: OK0.4 61.4,59.14 v61.25,59 | U1.14 24.42,48.17 v24.5,48.25
  Bottom 0.3: v61.25,59 57,59 55.5,57.5 55.5,10.75 49,4.25 28.75,4.25 26.5,6.5 26.5,47.5 25.5,48.5 24.75,48.5 v24.5,48.25 | R4.2 v61.25,59 | C1.1 v61.25,59
DC_X2  (via drill 0.3)
  Top 0.3: OK1.4 61.4,50.14 v61.25,50 | U1.13 25.08,43.92 v25.25,43.9
  Bottom 0.3: v61.25,50 57.5,50 56,48.5 56,10.5 49.25,3.75 28.5,3.75 26,6.25 26,43.25 v25.25,43.9 | R6.2 v61.25,50 | C2.1 v61.25,50
DC_X3  (via drill 0.3)
  Top 0.3: OK2.4 61.38,41.13 v61.25,41 | U1.11 24.42,37.58 v24.5,37.5
  Bottom 0.3: v61.25,41 58,41 56.5,39.5 56.5,10.25 49.5,3.25 28.25,3.25 25.5,6 25.5,35.25 24.75,36 24.75,37.25 v24.5,37.5 | R10.2 v61.25,41 | C3.1 v61.25,41
DC_X4  (via drill 0.3)
  Top 0.3: OK3.4 61.4,32.15 v61.25,32 | U1.10 23.79,36.96 v24,36.75
  Bottom 0.3: v61.25,32 58.5,32 57,30.5 57,10 49.75,2.75 28,2.75 25,5.75 25,34.75 24,35.75 v24,36.75 | R14.2 v61.25,32 | C4.1 v61.25,32
DC_X5  (via drill 0.3)
  Top 0.3: OK4.4 61.4,23.14 v61.25,23 | U1.9 23.13,36.37 v23.25,36.25
  Bottom 0.3: v61.25,23 59,23 57.5,21.5 57.5,9.75 50,2.25 27.75,2.25 24.5,5.5 24.5,34.5 23.25,35.75 v23.25,36.25 | v61.25,23 R18.2 | C5.1 v61.25,23
DC_X6  (via drill 0.3)
  Top 0.3: OK5.4 61.4,14.39 61.25,14.25 v61.25,14 | U1.8 22.46,35.78 v22.5,35.75
  Bottom 0.3: v61.25,14 59.25,14 58,12.75 58,9.5 50.25,1.75 27.5,1.75 24,5.25 24,33.5 22.75,34.75 22.75,35.5 v22.5,35.75 | v61.25,14 R22.2 | C6.1 v61.25,14
DC_X7  (via drill 0.3)
  Top 0.3: U1.7 21.83,35.17 v22,35 | v61,5 61,6.07 OK6.4
  Bottom 0.3: v22,35 22,34.5 23.5,33 23.5,5 27.25,1.25 51,1.25 56.4,6.65 C7.1 | R26.2 C7.1 | C7.1 61.25,5.25 v61,5
DC_X8  (via drill 0.3)
  Top 0.3: U1.20 20.54,51.03 v20.75,51.25 | OK7.4 43.4,50.39 v43,50
  Bottom 0.3: 38.75,45.5 38.75,45.75 41.75,48.75 43.15,48.75 R30.2 43.25,49.75 v43,50 | 38.75,45.5 38.75,10.75 35.25,7.25 30.25,7.25 29.5,8 29.5,49 26.5,52 21.5,52 v20.75,51.25 | C8.1 39,45.75 38.75,45.5
DC_X9  (via drill 0.3)
  Top 0.3: OK8.4 43.4,41.14 v43.25,41 | U1.19 21.25,45.25 21.25,50.5 v22,51.25
  Bottom 0.3: v43.25,41 40.75,41 39.25,39.5 39.25,10.5 35.5,6.75 30,6.75 29,7.75 29,48.75 26.25,51.5 22.25,51.5 v22,51.25 | C9.1 v43.25,41 | R34.2 v43.25,41
DC_X10  (via drill 0.3)
  Top 0.3: OK9.4 43.4,32.15 v43.25,32 | U1.18 21.83,50.08 v22,50.25
  Bottom 0.3: v43.25,32 41.25,32 39.75,30.5 39.75,10.25 35.75,6.25 29.75,6.25 28.5,7.5 28.5,48.5 26,51 22.75,51 v22,50.25 | C10.1 v43.25,32 | R38.2 v43.25,32
DC_X11  (via drill 0.3)
  Top 0.3: OK10.4 43.4,23.14 v43.25,23 | U1.17 22.46,49.47 v23.25,50.25
  Bottom 0.3: v43.25,23 41.75,23 40.25,21.5 40.25,10 36,5.75 29.5,5.75 28,7.25 28,48.25 25.75,50.5 23.5,50.5 v23.25,50.25 | C11.1 v43.25,23 | R42.2 v43.25,23
DC_X12  (via drill 0.3)
  Top 0.3: OK11.4 43.4,14.14 v43.25,14 | U1.16 23.13,49.13 v23.25,49.25
  Bottom 0.3: v43.25,14 42.25,14 40.75,12.5 40.75,9.75 36.25,5.25 29.25,5.25 27.5,7 27.5,48 25.5,50 24,50 v23.25,49.25 | C12.1 v43.25,14 | R46.2 v43.25,14
DC_X13  (via drill 0.3)
  Top 0.3: U1.15 23.79,48.79 v24.25,49.25 | 43.35,6.5 OK12.4 43.94,7 44,7 44.5,7.5 v44.5,7.75
  Bottom 0.3: v24.25,49.25 25.5,49.25 27,47.75 27,6.75 29,4.75 36.5,4.75 39.25,7.5 42.1,7.5 R50.2 C13.1 44.6,7.65 v44.5,7.75
DC_X14  (via drill 0.3)
  Top 0.3: OK13.4 18.96,21.21 19,21.25 19,21.75 20,22.75 v20.5,22.75 | U1.6 21.17,36.17 v21,36 20.92,36.08
  Bottom 0.3: v20.5,22.75 20.5,29.5 | 20.5,29.5 20.25,29.75 20.25,33.5 21,34.25 v21,36 | R54.2 C14.1 20.9,29.1 20.5,29.5
DC_X15  (via drill 0.3)
  Top 0.3: OK14.4 17.14,5.86 v17,6 | U1.5 20.54,37.28 v20.5,37.25
  Bottom 0.3: v17,6 17,9.25 | 17,9.25 17,9.5 | 17,9.5 19.75,12.25 19.75,33.75 20.25,34.25 20.25,36.5 20.5,36.75 v20.5,37.25 | R58.2 16.1,8.6 17,9.5 | C15.1 17.65,8.6 17,9.25
DC_X16  (via drill 0.3)
  Top 0.3: OK15.4 8,5.86 8,7 v7.5,7.5 | U1.4 19.87,36.37 v19.5,36
  Bottom 0.3: v7.5,7.5 7.5,8 10,10.5 10.25,10.5 | 10.25,10.5 17,10.5 19.25,12.75 19.25,34.25 19.5,34.5 v19.5,36 | R62.2 C16.1 10,10.25 10.25,10.5
DETECT_DEMUX_P1
  Top 0.3: R66.1 14,40.25 13.25,39.5 13.25,38.75 12.25,37.75 12.25,36.75 10.5,35 10.27,35 J1.7
  Top 0.6: J3.7 J1.7
DETECT_DEMUX_P2
  Top 0.3: R67.1 14,38.75 12.75,37.5 12.75,36.25 12.25,35.75 12.25,33.75 10.75,32.25 10.06,32.25 J1.8
  Top 0.6: J3.8 J1.8
DETECT_DEMUX_P3
  Top 0.3: R68.1 13.75,37.25 13.25,36.75 13.25,36 12.75,35.5 12.75,31.75 10.75,29.75 10.1,29.75 J1.9
  Top 0.6: J3.9 J1.9
DETECT_DEMUX_P4
  Top 0.3: R69.1 14,35.75 13.25,35 13.25,29.25 11,27 10.11,27 J1.10
  Top 0.6: J3.10 J1.10
GND  (via drill 0.3)
  Top 0.3: 25,40.75 v25,41 25.08,40.92 U1.12 | 13.75,45.12 C28.2 | v63,18 63.25,17.75 | v63,36 63.25,35.75 | v63,45 63.25,44.25 | v45,45 45.25,44.75 | v45,36 45.25,35.75 | v45,18 45.25,17.75 | v62.88,9.12 63.12,9.12 63.25,9
  Top 0.4: 21.5,5 21,4.5 | 21,4.5 v10.5,4.5 10.5,5.5 OK15.5 | v21.5,4.5 21,4.5
  Top 0.6: J3.6 J1.6 10.27,37.27 12.25,39.25 12.25,40.25 13.5,41.5 v16,41.5 16.75,42.25 23.75,42.25 v25,41 27,39 27,28.5 24.75,26.25 v21.5,26.25 | OK0.5 62.75,63 v63,62.75 63.25,62.5 63.25,54 | 63.25,54 63.25,45 | 63.25,45 63.25,44.25 63.25,36 | 63.25,36 63.25,35.75 63.25,27 | 63.25,27 63.25,18 | 63.25,18 63.25,17.75 63.25,9.5 | 63.25,9.5 v62.88,9.12 62.75,9 OK6.5 | OK5.5 v63,18 63.25,18 | OK4.5 v63,27 63.25,27 | OK3.5 v63,36 63.25,36 | OK2.5 v63,45 63.25,45 | OK1.5 v63,54 63.25,54 | OK7.5 44.75,54.75 45.25,54.25 45.25,45 | 45.25,45 45.25,44.75 45.25,36 | 45.25,36 45.25,35.75 45.25,27 | 45.25,27 45.25,18 | 45.25,18 45.25,17.75 45.25,9.25 | 45.25,9.25 45.25,9 45.5,8.75 45.5,3.75 46,3.25 v55.5,3.25 | OK12.5 44.75,9 v45,9.25 45.25,9.25 | OK11.5 v45,18 45.25,18 | OK10.5 v45,27 45.25,27 | OK9.5 v45,36 45.25,36 | OK8.5 v45,45 45.25,45 | v21.5,22.5 OK13.5 | OK14.5 v21.5,4.5 24.75,1.25 59,1.25 63.25,5.5 63.25,8.75 | 13.75,45.12 v13.75,44.25 | 63.25,8.75 63.25,9 63.25,9.5 | 63,9 63.25,8.75
  Bottom 0.3: v25,41 24.73,40.73 SJ1.1 SJ2.1 | C6.2 61.25,17.86 OK5.5 v63,18 | C5.2 61.25,26.86 OK4.5 v63,27 | C4.2 61.25,35.85 OK3.5 v63,36 | C3.2 61.25,44.87 OK2.5 v63,45 | C2.2 61.25,53.86 OK1.5 v63,54 | C1.2 61.25,62.86 OK0.5 62.75,63 v63,62.75 | C9.2 43.25,44.86 OK8.5 | OK8.5 v45,45 | C10.2 43.25,35.85 OK9.5 v45,36 | C11.2 43.25,26.86 OK10.5 v45,27 | C12.2 43.25,17.86 OK11.5 v45,18 | C13.2 43.5,9.11 43.65,9 44.75,9 v45,9.25 | C16.2 10,5 v10.5,4.5 | C15.2 21.35,6.9 21.5,6.75 | C7.2 61.25,8.86 OK6.5 62.75,9 v62.88,9.12 | C8.2 42.65,45.75 OK8.5 | 17,40.5 17.27,40.5 SJ3.1
  Bottom 0.6: v21.5,4.5 21.5,6.75 v21.5,22.5 v21.5,26.25 C14.2 | 17,40.5 v16,41.5 16,43.25 15,44.25 v13.75,44.25 | v55.5,3.25 61,3.25 63.25,5.5 63.25,8.75 v62.88,9.12 63.12,8.88
I2C1_SCL  (via drill 0.3)
  Top 0.3: v17.25,52.25 2.25,52.25 v2,52.5
  Top 0.6: J3.11 J1.11
  Bottom 0.3: SJ4.1 24.02,46.73 22.5,48.25 21.25,48.25 v17.25,52.25 | J3.11 3.93,24.5 3,24.5 1.25,26.25 1.25,51.75 v2,52.5
I2C1_SDA  (via drill 0.3)
  Top 0.3: J1.12 2.47,22.03 1.25,23.25 1.25,50.75 2,51.5 14.25,51.5 v16.5,49
  Top 0.6: J3.12 J1.12
  Bottom 0.3: 18.5,46.27 SJ5.1 18.25,46.52 18.25,47.25 v16.5,49
I2C3_SCL
  Top 0.6: J3.1 J1.1
  Bottom 0.3: SJ4.3 20.98,46.52 19.75,47.75 19,47.75 17,49.75 10.22,49.75 J1.1
I2C3_SDA
  Top 0.6: J3.2 J1.2
  Bottom 0.3: SJ5.3 15.48,46.77 14.75,47.5 10.07,47.5 J1.2
IN_STIMN_D1  (via drill 0.3)
  Top 0.3: K3.8 49.5,66.5 50.25,65.75 G1.A
  Top 0.6: OK0.2 52.1,62.86 51.75,62.5 G1.A v50.25,61.75 RED1.C RED2.C 50.25,58.65 R3.2 50.31,58.59
  Bottom 0.3: G1.A v50.25,61.75
IN_STIMN_D2  (via drill 0.3)
  Top 0.3: G3.A 50.25,53 v49.75,53
  Top 0.6: G3.A G4.A | G4.A 50.25,53 RED3.C RED4.C 50.25,49.65 R8.2 | OK1.2 G4.A
  Bottom 0.3: K3.11 43.75,63.9 43.75,59.25 49.75,53.25 v49.75,53
IN_STIMN_D3  (via drill 0.3)
  Top 0.3: G5.A v50.24,44.01 v50.25,44
  Top 0.6: G5.A G6.A | G6.A RED5.C RED6.C 50.24,40.66 R12.2 | G6.A OK2.2
  Bottom 0.3: v50.25,44 50.25,50.25 41.75,58.75 41.75,60.5 42.5,61.25 42.5,65.25 43.75,66.5 K3.6
IN_STIMN_D4  (via drill 0.3)
  Top 0.3: G7.A v50.25,35
  Top 0.6: G7.A G8.A | G8.A v50.25,35 RED7.C RED8.C 50.25,31.65 R16.2 | G8.A OK3.2
  Bottom 0.3: v50.25,35 50.25,40.75 48.25,42.75 48.25,50.25 39.75,58.75 39.75,60.75 41.27,62.27 K3.12
IN_STIMN_D5  (via drill 0.3)
  Top 0.4: G9.A v50.25,26
  Top 0.6: G9.A G10.A | G10.A v50.25,26 RED9.C RED10.C 50.25,22.65 R20.2 | G10.A OK4.2
  Bottom 0.3: v50.25,26 51.5,27.25 51.5,53.5 45,60 45,65.15 K3.7
IN_STIMN_D6  (via drill 0.3)
  Top 0.4: G11.A v50.25,17
  Top 0.6: G11.A G12.A | G12.A v50.25,17 RED11.C RED12.C 50.25,13.65 R24.2 | G12.A OK5.2
  Bottom 0.3: 50.25,17.25 52.5,19.5 52.5,54.5 46.25,60.75 46.25,63.5 46.25,63.86 K3.10
  Bottom 0.4: v50.25,17 50.25,17.25
IN_STIMN_D7  (via drill 0.3)
  Top 0.4: G13.A v50.25,8
  Top 0.6: G13.A G14.A | G14.A v50.25,8 RED13.C RED14.C 50.25,4.65 R28.2 | G14.A OK6.2
  Bottom 0.3: v50.25,8 53.5,11.25 53.5,55.75 47.75,61.5 47.75,63.5 48.25,64 48.93,64 K3.9
IN_STIMN_D8  (via drill 0.3)
  Top 0.3: G15.A v32.25,53.75
  Top 0.6: G15.A G16.A | G16.A v32.25,53.75 RED15.C RED16.C 32.25,50.4 R32.2 | G16.A OK7.2
  Bottom 0.3: v32.25,53.75 32.25,55 30.5,56.75 30.5,58.5 34.88,62.88 34.88,65.12 36.19,66.44 K3.3
IN_STIMN_D9  (via drill 0.3)
  Top 0.3: G17.A v32.25,44
  Top 0.6: G17.A G18.A | G18.A v32.25,44 RED17.C RED18.C 32.25,40.65 R36.2 | G18.A OK8.2
  Bottom 0.3: v32.25,44 32.5,44.25 32.5,51 31.5,52 31.5,54.5 29.5,56.5 29.5,58.75 33.5,62.75 33.5,63.81 K3.15
IN_STIMN_D10  (via drill 0.3)
  Top 0.3: G19.A v32.25,35
  Top 0.6: G19.A G20.A | G20.A v32.25,35 RED19.C RED20.C 32.25,31.65 R40.2 | G20.A OK9.2
  Bottom 0.3: v32.25,35 33.5,36.25 33.5,55.25 31.5,57.25 31.5,58.25 36.25,63 36.25,63.9 K3.14
IN_STIMN_D11  (via drill 0.3)
  Top 0.3: G21.A v32.25,26
  Top 0.6: G21.A G22.A | G22.A v32.25,26 RED21.C RED22.C 32.25,22.65 R44.2 | G22.A OK10.2
  Bottom 0.3: v32.25,26 35,28.75 35,59.75 37.5,62.25 37.5,65.25 38.73,66.48 K3.4
IN_STIMN_D12  (via drill 0.3)
  Top 0.3: G23.A v32.25,17
  Top 0.6: G23.A G24.A | G24.A v32.25,17 RED23.C RED24.C 32.25,13.65 R48.2 | G24.A OK11.2
  Bottom 0.3: v32.25,17 36.5,21.25 36.5,58 36,58.5 36,59.5 38.73,62.23 K3.13
IN_STIMN_D13  (via drill 0.3)
  Top 0.3: G25.A v32.25,8
  Top 0.6: G25.A G26.A | G26.A v32.25,8 RED25.C RED26.C 32.25,4.65 R52.2 | G26.A OK12.2
  Bottom 0.3: v32.25,8 37.5,13.25 37.5,59.5 40,62 40,65 41.27,66.27 K3.5
IN_STIMN_D14  (via drill 0.3)
  Top 0.3: v19.75,58.5 14.75,58.5 v11.25,55
  Top 0.6: G27.A G28.A | G28.A RED27.C RED28.C 17.15,32 | G28.A OK13.2 | 17.15,32 R56.2 | 17.15,32 16,32 v15.75,31.75
  Bottom 0.3: v15.75,31.75 14.25,31.75 12.5,33.5 8.5,33.5 8,34 8,51.75 v11.25,55 | v19.75,58.5 27.5,58.5 32.38,63.38 32.38,65.22 K3.2
IN_STIMN_D15  (via drill 0.3)
  Top 0.3: 7,53.75 v6.75,53.75 7.5,53.75 14,60.25 v18,60.25
  Top 0.6: G29.A G30.A | G30.A RED29.C RED30.C 17.15,17 | G30.A OK14.2 | 17.15,17 R60.2 | 17.15,17 16,17 v15.5,16.5
  Bottom 0.3: v15.5,16.5 12.75,16.5 9.75,19.5 7.5,19.5 6.5,20.5 6.5,53.5 v6.75,53.75 | v18,60.25 26.5,60.25 29.5,63.25 29.5,65.75 30.25,66.5 K3.1 30.86,66.25
IN_STIMN_D16  (via drill 0.3)
  Top 0.3: 5.65,17 v9,17 | v4.25,53 8,53 14.5,59.5 v18.75,59.5
  Top 0.6: OK15.2 G31.A G32.A v9,17 RED31.C RED32.C 5.65,17 R64.2
  Bottom 0.3: v4.25,53 5.5,51.75 5.5,18 6.5,17 v9,17 | v18.75,59.5 27,59.5 31,63.5 31,63.85 K3.16 31.07,64
IN_STIMP_D1  (via drill 0.3)
  Top 0.3: 48.65,62.1 48.75,62 48.5,62 | 48.5,62 42.75,62 42,62.75 28.5,62.75 27.75,63.5 27.75,65.14 K2.8 | v48.75,61.75 48.5,62
  Top 0.6: G2.C 48.75,62 v48.75,61.75 RED1.A RED2.A 48.75,58.65 R2.2 48.81,58.72
  Bottom 0.5: G2.C v48.75,61.75 49.75,60.75 51.5,60.75 52,61.25 R1.2
IN_STIMP_D2  (via drill 0.3)
  Top 0.3: R5.2 48.65,53.1 v48.75,53 | v42.75,59 41,60.75 25,60.75 22.5,63.25 22.5,65.31 K2.6
  Top 0.6: R5.2 48.75,56.65 G3.C G4.C v48.75,53 RED3.A RED4.A 48.75,49.65 R7.2
  Bottom 0.3: v48.75,53 v42.75,59
IN_STIMP_D3  (via drill 0.3)
  Top 0.3: 48.74,47.9 48.74,44.01 v49.25,44 | v40.75,58.75 39.25,60.25 24.25,60.25 21.25,63.25 21.25,63.9 K2.11
  Top 0.6: R9.2 48.74,47.9 G5.C G6.C RED5.A RED6.A 48.74,40.64 R11.2
  Bottom 0.3: v49.25,44 49.25,50.25 v40.75,58.75
IN_STIMP_D4  (via drill 0.3)
  Top 0.3: 48.75,38.9 v48.75,35 | v38.5,59 38.5,59.25 38,59.75 27,59.75 26.5,59.25 24,59.25 20,63.25 20,65.27 K2.5
  Top 0.6: R13.2 48.75,38.9 G7.C G8.C v48.75,35 RED7.A RED8.A 48.75,31.65 R15.2
  Bottom 0.3: v48.75,35 48.75,41.5 47.75,42.5 47.75,49.75 v38.5,59
IN_STIMP_D5  (via drill 0.3)
  Top 0.3: v45,59 44.25,59.75 42.75,59.75 41.25,61.25 25.75,61.25 23.75,63.25 23.75,63.86 K2.10
  Top 0.4: 48.75,29.9 v48.75,26
  Top 0.6: R17.2 48.75,29.9 G9.C G10.C v48.75,26 RED9.A RED10.A 48.75,22.65 R19.2
  Bottom 0.3: 48.75,26.25 51,28.5 51,53 v45,59
  Bottom 0.4: v48.75,26 48.75,26.25
IN_STIMP_D6  (via drill 0.3)
  Top 0.3: v46.25,59.75 45.75,60.25 43,60.25 41.5,61.75 26.5,61.75 25,63.25 25,65.35 K2.7
  Top 0.4: 48.75,20.9 v48.75,17
  Top 0.6: R21.2 48.75,20.9 G11.C G12.C v48.75,17 RED11.A RED12.A 48.75,13.65 R23.2
  Bottom 0.3: v48.75,17 52,20.25 52,54 v46.25,59.75
IN_STIMP_D7  (via drill 0.3)
  Top 0.3: v47.25,60.75 43.25,60.75 41.75,62.25 27.5,62.25 26.25,63.5 26.25,63.82 K2.9
  Top 0.4: G13.C v48.75,8 | R25.2 48.65,11.6 48.75,11.5
  Top 0.6: R27.2 48.75,4.65 RED14.A RED13.A v48.75,8 G14.C G13.C 48.75,11.65 R25.2
  Bottom 0.3: v48.75,8 53,12.25 53,55.25 47.5,60.75 v47.25,60.75
IN_STIMP_D8  (via drill 0.3)
  Top 0.6: G16.C v30.75,53.75 RED15.A RED16.A 30.75,50.4 R31.2 | G16.C G15.C | R29.2 30.65,54.65 G16.C
  Bottom 0.3: v30.75,53.75 27.5,57 20.25,57 15,62.25 15,65.19 K2.3
IN_STIMP_D9  (via drill 0.3)
  Top 0.3: 30.66,47.95 30.66,44.09 v30.75,44
  Top 0.6: 30.66,47.95 R33.2 30.75,47.65 G17.C G18.C v30.75,44 RED17.A RED18.A 30.75,40.65 R35.2
  Bottom 0.3: v30.75,44 30.75,49.75 25.75,54.75 20,54.75 11.25,63.5 11,63.81 K2.15
IN_STIMP_D10  (via drill 0.3)
  Top 0.3: R37.2 30.65,35.1 v30.75,35
  Top 0.6: 30.5,38.65 R37.2 30.75,38.65 G19.C G20.C v30.75,35 RED19.A RED20.A 30.75,31.65 R39.2 30.5,31.6
  Bottom 0.3: v30.75,35 30.75,41.75 31.5,42.5 31.5,50.25 25.75,56 20,56 13.5,62.5 13.5,63.77 K2.14
IN_STIMP_D11  (via drill 0.3)
  Top 0.3: 30.84,29.95 30.84,26.09 v30.75,26 | v32.5,58 28.25,58 27.25,57 22.5,57 16.25,63.25 16.25,63.98 K2.13
  Top 0.6: 30.84,29.95 R41.2 30.75,29.65 G21.C G22.C v30.75,26 RED21.A RED22.A 30.75,22.65 R43.2
  Bottom 0.3: v30.75,26 34.5,29.75 34.5,56 v32.5,58
IN_STIMP_D12  (via drill 0.3)
  Top 0.3: 30.85,20.95 30.85,17.1 v30.75,17 | v35.75,57.5 35.75,58.25 35.25,58.75 28,58.75 27,57.75 23,57.75 17.5,63.25 17.5,65.23 K2.4
  Top 0.6: 30.85,20.95 R45.2 30.75,20.65 G23.C G24.C v30.75,17 RED23.A RED24.A 30.75,13.65 R47.2
  Bottom 0.3: v30.75,17 35.75,21.75 v35.75,57.5
IN_STIMP_D13  (via drill 0.3)
  Top 0.3: 30.85,11.95 30.85,8.1 v30.75,8 | v36.75,59 36.5,59.25 27.5,59.25 26.75,58.5 23.5,58.5 18.75,63.25 18.75,63.94 K2.12
  Top 0.6: 30.85,11.95 R49.2 30.75,11.65 G25.C G26.C v30.75,8 RED25.A RED26.A 30.75,4.65 R51.2
  Bottom 0.3: v30.75,8 37,14.25 37,58.75 v36.75,59
IN_STIMP_D14  (via drill 0.3)
  Top 0.3: R53.2 24.9,33.6 25.75,32.75 25.75,29 24.25,27.5 18.5,27.5 18,27 v16,27
  Top 0.6: 24.45,33.4 R53.2 24.15,33.5 G27.C G28.C RED27.A RED28.A R55.2 17.15,33.5
  Bottom 0.3: v16,27 13,27 11.88,25.88 7.88,25.88 7.5,26.25 7.5,52.25 10,54.75 10,65.35 K2.2
IN_STIMP_D15  (via drill 0.3)  (1 unrouted)
  Top 0.3: R57.2 17.1,18.6 17,18.5
  Top 0.6: 24.45,18.4 R57.2 24.15,18.5 G29.C G30.C RED29.A RED30.A 17.15,18.5 R59.2 | 17,18.5 16,18.5 v15.5,18
  Bottom 0.3: v15.5,18 13,18 10.75,20.25 8.25,20.25 7,21.5 7,52.75 8.75,54.5 8.75,63.82 K2.16 8.5,63.85
IN_STIMP_D16  (via drill 0.3)
  Top 0.3: 14.75,18.4 9.1,18.4 v9,18.5
  Top 0.6: RED32.A RED31.A v9,18.5 G32.C G31.C 13.15,18.5 R61.2 12.95,18.4 14.75,18.4 R63.2
  Bottom 0.3: K2.1 8.36,66.25 7.75,66.25 7,65.5 7,63 7.75,62.25 7.75,56 6,54.25 6,19.5 RED32.A v9,18.5
N$1
  Top 0.6: OK1.1 50.56,56.54 R5.1
N$2
  Top 0.6: R9.1 51.97,47.75 OK2.1
N$3
  Top 0.6: R13.1 51.98,38.75 OK3.1
N$4
  Top 0.6: R17.1 51.98,29.75 OK4.1
N$5
  Top 0.6: R21.1 51.98,20.75 OK5.1
N$6
  Top 0.6: R25.1 51.98,11.75 OK6.1
N$7
  Top 0.6: 33.9,57 OK7.1 33.56,56.75 29.75,56.75 29.35,56.35 R29.1
N$8
  Top 0.6: OK9.1 32.31,38.54 R37.1
N$9
  Top 0.6: OK8.1 32.56,47.54 R33.1
N$10
  Top 0.6: OK10.1 32.56,29.54 R41.1
N$11
  Top 0.6: OK11.1 32.56,20.54 R45.1
N$12
  Top 0.6: OK12.1 32.56,11.54 R49.1
N$13
  Top 0.6: OK13.1 24.04,31.69 R53.1
N$14
  Top 0.6: OK14.1 24.04,16.69 R57.1
N$15
  Top 0.6: OK15.1 13,15.5 13,16.69 13.04,16.69 R61.1
N$16  (via drill 0.3)
  Top 0.3: U1.21 19.87,44.38 21,43.25 24.5,43.25 v25,42.75
  Bottom 0.3: v25,42.75 24.5,42.25 SJ1.2
N$17  (via drill 0.3)
  Top 0.3: U1.2 18.58,38.08 v18.5,38
  Bottom 0.3: SJ2.2 20.5,42.25 19.75,41.5 19.75,40.5 U1.2 18.58,38.08 v18.5,38
N$18  (via drill 0.3)
  Top 0.3: U1.3 19.21,40.79 v19,41
  Bottom 0.3: SJ3.2 17.75,42 18.75,42 19,41.75 v19,41
N$30  (via drill 0.3)
  Top 0.5: v53.5,65.25 52.4,65.25 OK0.1
  Top 0.6: 52.05,65.75 OK0.1
  Bottom 0.5: R1.1 53.1,64.85 v53.5,65.25
SCL  (via drill 0.3)
  Top 0.3: U1.22 19.21,48.54 v19.25,48.75
  Bottom 0.3: SJ4.2 22.5,47 22,47.5 21,47.5 20,48.5 19.25,48.5 v19.25,48.75
SDA  (via drill 0.3)
  Top 0.3: U1.23 18.58,46.17 17.25,47.5 v16.75,47.5
  Bottom 0.3: v16.75,47.5 16.75,46.75 17,46.5 SJ5.2
STIM_OUT
  Top 0.6: J3.3 J1.3
  Bottom 0.6: R71.1 16.25,35.75 15,37 14.1,37 R70.1 14,37 13,38 13,42.5 10.75,44.75 10.14,44.75 J1.3
STIMN  (via drill 0.3)
  Top 0.6: R2.1 R7.1 v46.9,48 R11.1 R15.1 R19.1 R23.1 R27.1 | 28.9,24.35 R39.1 R35.1 28.9,48.5 | 28.9,22.6 R43.1 R47.1 R51.1 | 14.75,33.5 14.75,25.75 | 14.75,25.75 14.75,20.35 | 14.75,20.35 R59.1 | 14.75,20.35 14.5,20.35 R63.1 | R55.1 14.75,33.5 | 14.75,25.75 15.5,25 28.25,25 28.9,24.35 | 28.9,24.35 28.9,22.6 | 28.9,22.6 29,22.5 28.75,22.5 | 14.75,33.5 14.75,33.75 v14.25,34.25 | R31.1 28.9,49.85 29,49.75 28.9,49.65 28.9,48.5 | v38.5,49 29.4,49 28.9,48.5
  Bottom 0.6: v38.5,49 39.75,49 42,51.25 43.75,51.25 44.25,50.65 v46.9,48 | v14.25,34.25 14.25,35.15 R70.2
STIMP  (via drill 0.3)
  Top 0.6: R3.1 53.5,58.5 54.75,57.25 54.75,50 | 54.75,50 54.75,41 | 54.75,41 54.75,32 | 54.75,32 54.75,23 | 54.75,23 54.75,14 | R28.1 53.5,4.5 54.75,5.75 v54.75,13.75 54.75,14 | R24.1 54.25,13.5 54.75,14 | R20.1 54.25,22.5 54.75,23 | R16.1 54.25,31.5 54.75,32 | R12.1 54.25,40.5 54.75,41 | R8.1 54.25,49.5 54.75,50 | 36.75,41 36.75,45.5 39.75,48.5 39.75,49.5 39,50.25 R32.1 | 36.75,41 36.75,31.75 | 36.75,31.75 36.75,23 | R48.1 36.25,13.5 36.75,14 | R44.1 36.25,22.5 36.75,23 | R40.1 36.5,31.5 36.75,31.75 | R36.1 36.25,40.5 36.75,41 | R52.1 35.25,4.5 | 36.25,5.5 36.75,6 36.75,14 | 36.75,14 36.75,23 | R64.1 5.5,14 6.5,13 16,13 v17,14 | v17,14 R60.1 | R56.1 v17,28.25 | v17,14 17,13.25 18.25,12 23.75,12 25.75,10 25.75,4.5 27,3.25 34,3.25 35.25,4.5 | v38.75,5.5 36.25,5.5 | 36.25,5.5 35.25,4.5
  Bottom 0.6: v17,14 v17,28.25 17,33.25 16.65,33.5 R71.2 | v54.75,13.75 54.75,11 50,6.25 39.5,6.25 v38.75,5.5

### Text on the board
tPlace: Demux Input MINUS | CH1 | Demux Input / MINUS | - | + | CH8 | CH2 | MINUS Input | - | - | + | + | opt. | CH9 | CH3 | - | - | + | + | <-INT select | CH10 | CH4 | - | - | - | + | + | + | Stimulation Testbed / -> DEMUX Expansion | CH11 | CH5 | CH14 | - | - | - | + | + | - | CH12 | CH6 | + | - | - | Berlin | + | + | + | CH16 | CH15 | CH13 | CH7 | TU | - | - | + | + | Valtin - Rev. 1 - 30.07.2018 - ID: RS287
bPlace: Demux Input PLUS | Demux Input PLUS | PLUS Input | <- I2C3 | <- I2C1/2 | <- I2C3 | <- I2C1/2 | opt. | +3.3V-> | GND-> | <- / Addr. 2 | > | PLUS Input | Addr. 1 -> | Addr. 0 -> | Stimulation Testbed / -> DEMUX Expansion | MINUS Input> | Berlin | TU | Valtin - Rev. 1 - 30.07.2018 - ID: RS287